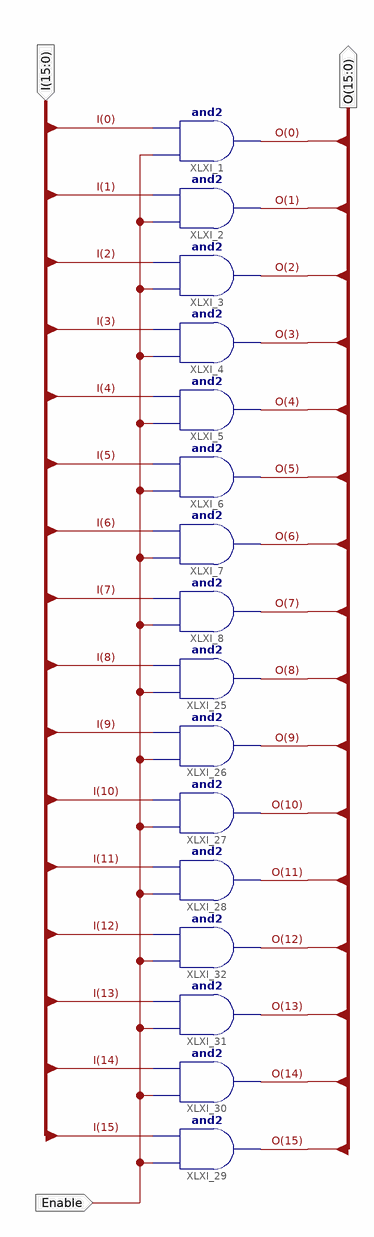
[diagram p0: schematic sheet 1]
// Xilinx ISE schematic buf16be.sch (spartan6) as structural Verilog: 16 symbols, 3 ports
module buf16be (
  input  Enable,
  input  [15:0] I,
  output [15:0] O
);

  and XLXI_1 (O[0], Enable, I[0]);
  and XLXI_2 (O[1], Enable, I[1]);
  and XLXI_3 (O[2], Enable, I[2]);
  and XLXI_4 (O[3], Enable, I[3]);
  and XLXI_8 (O[7], Enable, I[7]);
  and XLXI_7 (O[6], Enable, I[6]);
  and XLXI_6 (O[5], Enable, I[5]);
  and XLXI_5 (O[4], Enable, I[4]);
  and XLXI_25 (O[8], Enable, I[8]);
  and XLXI_26 (O[9], Enable, I[9]);
  and XLXI_27 (O[10], Enable, I[10]);
  and XLXI_28 (O[11], Enable, I[11]);
  and XLXI_29 (O[15], Enable, I[15]);
  and XLXI_30 (O[14], Enable, I[14]);
  and XLXI_31 (O[13], Enable, I[13]);
  and XLXI_32 (O[12], Enable, I[12]);
endmodule
